# EAGLE design arcReactor (EAGLE 8.5.2)

## Sheet 1 of 2
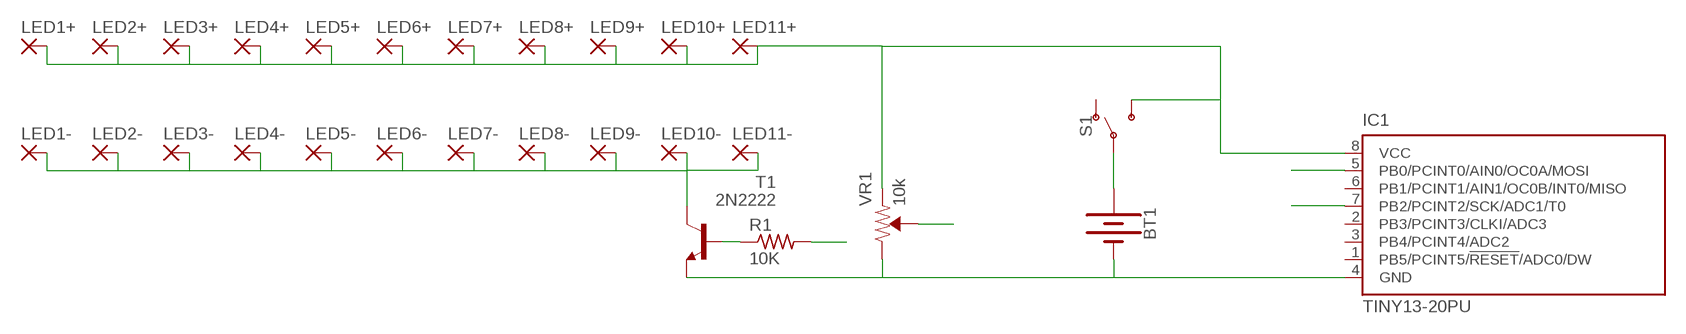
[diagram p0: schematic, sheet 1]

### Parts
BT1  BATTERY-20MM_PTH  [BATTCOM_20MM_PTH]
IC1  TINY13-20PU  [DIL08]
LED1+  SMD2  [SMD1,27-2,54]
LED1-  SMD2  [SMD1,27-2,54]
LED2+  SMD2  [SMD1,27-2,54]
LED2-  SMD2  [SMD1,27-2,54]
LED3+  SMD2  [SMD1,27-2,54]
LED3-  SMD2  [SMD1,27-2,54]
LED4+  SMD2  [SMD1,27-2,54]
LED4-  SMD2  [SMD1,27-2,54]
LED5+  SMD2  [SMD1,27-2,54]
LED5-  SMD2  [SMD1,27-2,54]
LED6+  SMD2  [SMD1,27-2,54]
LED6-  SMD2  [SMD1,27-2,54]
LED7+  SMD2  [SMD1,27-2,54]
LED7-  SMD2  [SMD1,27-2,54]
LED8+  SMD2  [SMD1,27-2,54]
LED8-  SMD2  [SMD1,27-2,54]
LED9+  SMD2  [SMD1,27-2,54]
LED9-  SMD2  [SMD1,27-2,54]
LED10+  SMD2  [SMD1,27-2,54]
LED10-  SMD2  [SMD1,27-2,54]
LED11+  SMD2  [SMD1,27-2,54]
LED11-  SMD2  [SMD1,27-2,54]
R1  10K  R-US_0204/2V  [0204V]
S1  SWITCH-SPDT-PTH-11.6X4.0MM  [SWITCH_SPDT_PTH_11.6X4.0MM]
T1  2N2222  [TO92-EBC-OVAL]
VR1  10k  TRIMPOT-PTH-10MM-KNOB-1/2W-10%  [TRIMPOT-PTH-3386U]

### Nets
N$1: BT1.1(+) S1.2(P)
N$2: BT1.2(-) IC1.4(GND) T1.E VR1.3(CW)
N$3: IC1.8(VCC) LED1+.1(P) LED2+.1(P) LED3+.1(P) LED4+.1(P) LED5+.1(P) LED6+.1(P) LED7+.1(P) LED8+.1(P) LED9+.1(P) LED10+.1(P) LED11+.1(P) S1.3(S) VR1.1(CCW)
N$4: R1.1 T1.B
N$5: LED1-.1(P) LED2-.1(P) LED3-.1(P) LED4-.1(P) LED5-.1(P) LED6-.1(P) LED7-.1(P) LED8-.1(P) LED9-.1(P) LED10-.1(P) LED11-.1(P) T1.C
POTSENSE: IC1.7(PB2/PCINT2/SCK/ADC1/T0) VR1.2(WIPER)
PWMCTRL: IC1.5(PB0/PCINT0/AIN0/OC0A/MOSI) R1.2
Unconnected: IC1.1(PB5/PCINT5/!RESET!/ADC0/DW) IC1.2(PB3/PCINT3/CLKI/ADC3) IC1.3(PB4/PCINT4/ADC2) IC1.6(PB1/PCINT1/AIN1/OC0B/INT0/MISO) S1.1(O)

## Sheet 2 of 2

## Library data of the parts
BT1 = SparkFun-Batteries:BATTERY: Battery - Single Cell A variety of battery chemistries, sizes, and footprints. Device List: 20MM_PTH - Coin Cell Battery Holder - 20mm (PTH) <https://www.sparkfun.com/products/783> 6.8MM_PTH - Coin Cell Battery Holder - 6.8MM(SMD) <https://www.digikey.com/product-detail/en/seiko-instruments/MS621FE-FL11E/728-1057-ND/1889208?WT.srch=1&gclid=CNOQ5a6LzdQCFZS2wAodXCkE0g> 12MM_SMD - Coin Cell Battery Holder - 12mm (SMD) <https://www.sparkfun.com/products/10592> 12MM_PTH - Coin Cell Battery Holder - 12mm (PTH) <https://www.sparkfun.com/products/7948> 20MM_SMD - 20mm Coin Cell Battery Holder (SMD) (2 legs) Used on the Big Time Watch Kit <https://www.sparkfun.com/products/11734> 20MM_SMD_4LEGS - Coin Cell Battery Holder - 20mm (SMD) <https://www.sparkfun.com/products/11892> 20MM_SMD_4LEGS_OVERPASTE - Coin Cell Battery Holder - 20mm (SMD) <https://www.sparkfun.com/products/11892> (Over-paste on the legs) 24.5MM_PTH - Coin Cell Battery Holder - 24.5mm (PTH) <https://www.sparkfun.com/products/8863> 9V - 9V Battery Holder - PC Mount Used on the SparkFun SparkPunk Sound Kit <https://www.sparkfun.com/products/11177> and SparkFun SparkPunk Sequencer Kit <https://www.sparkfun.com/products/12707> 18650 - Battery Holder - 18650 (PTH) <https://www.sparkfun.com/products/13113> AA - Battery Holder - 1xAA (PTH) <https://www.sparkfun.com/products/7949> AAA - Battery Holder - 1xAAA (PTH) <https://www.sparkfun.com/products/12718> AA_KIT - Battery Holder - 1xAA (PTH) <https://www.sparkfun.com/products/7949> Special kit package - pads only have exposed copper on one side of the board. AAA_KIT - Battery Holder - 1xAAA (PTH) <https://www.sparkfun.com/products/12718> Special kit package - pads only have exposed copper on one side of the board.; PROD_ID: BATT-09031; SF_SKU: PRT-00783
IC1 = atmel:TINY13: 8-bit AVR Microcontroller with 1K Bytes In-System Programmable Flash Source: http://www.atmel.com/dyn/resources/prod_documents/2535S.pdf; MPN: ATTINY13-20PU; OC_FARNELL: 9171550; OC_NEWARK: 96K6521
LED1+ LED1- LED2+ LED2- LED3+ LED3- LED4+ LED4- LED5+ LED5- LED6+ LED6- LED7+ LED7- LED8+ LED8- LED9+ LED9- LED10+ LED10- LED11+ LED11- = wirepad:SMD2: SMD PAD
R1 = adafruit:R-US_: RESISTOR, American symbol
S1 = SparkFun-Switches:SWITCH-SPDT: Single Pole, Double Throw (SPDT) Switch Single-pole, double-throw (SPDT) switch. Variant Overview SMD-AYZ0202 Surface Mount DPDT Switch <https://www.sparkfun.com/products/597> (COM-00597) Used on e.g. LilyPad Arduino USB - ATmega32U4 Board <https://www.sparkfun.com/products/12049> PTH-11.6X4.0MM SPDT Mini Power Switch <https://www.sparkfun.com/products/102> (COM-00102) Used on e.g. SparkFun Simon Says - Through-Hole Soldering Kit <https://www.sparkfun.com/products/10547> (KIT-10547) PTH-11.6X4.0MM-KIT KIT version of SPDT Mini Power Switch - Simplifies soldering by removing tStop of switch pins - only one side can be soldered. PTH-11.6X4.0MM-LOCK LOCK version of SPDT Mini Power Switch - Offset pins hold switch in place for easier soldering. SMD-RIGHT-ANGLE Surface Mount Right Angle Switch <https://www.sparkfun.com/products/10860> (COM-10860) Used on e.g. SparkFun ESP8266 Thing <https://www.sparkfun.com/products/13231>; PROD_ID: SWCH-08261; SF_SKU: COM-00102
T1 = adafruit:2N2222: NPN TRANSISTOR Big oval pads
VR1 = SparkFun-Resistors:TRIMPOT: Trimming Potentiometer (Trimpot) Three-terminal potentiometers, with an adjustable wiper and two adjustable resistors. A pot can be used to create a configurable voltage divider, or as a variable resistor. "Trimpots" are a subset of potentiometers, usually intended for "set-and-forget" applications. They're often more delicate than standard potentiometers - rated for fewer turns. Variants PTH-KNOB - PTH Trimpot w/ finger-adjustable knob Trimpot 10K with Knob <https://www.sparkfun.com/products/9806> (COM-09806) Datasheet <http://www.sparkfun.com/datasheets/Components/General/TSR-3386.pdf> SMD-3MM-CLOSED-FRAME - SMD 3mm Square Closed-Frame Trimpot Used on e.g. EasyDriver - Stepper Motor Driver <https://www.sparkfun.com/products/12779> Datasheet <http://www.bitechnologies.com/pdfs/22.pdf> (22AR10KTR) SMD-5MM - SMD 5mm Square Closed-Frame Trimpot Used on e.g. IOIO-OTG - V2.2 <https://www.sparkfun.com/products/13613> Datasheet <http://www.vishay.com/docs/51008/ts53.pdf> (TS53YL502MR10) SMD-3MM-1/10W-25% - 3mm Square Open-Frame Trimpot Used on e.g. SparkFun Shapeoko <https://www.sparkfun.com/products/13899> Datasheet <http://www.bourns.com/docs/Product-Datasheets/TC33.pdf> (TC33X-2-103E); PROD_ID: RES-09730; SF_SKU: COM-09806

## Board
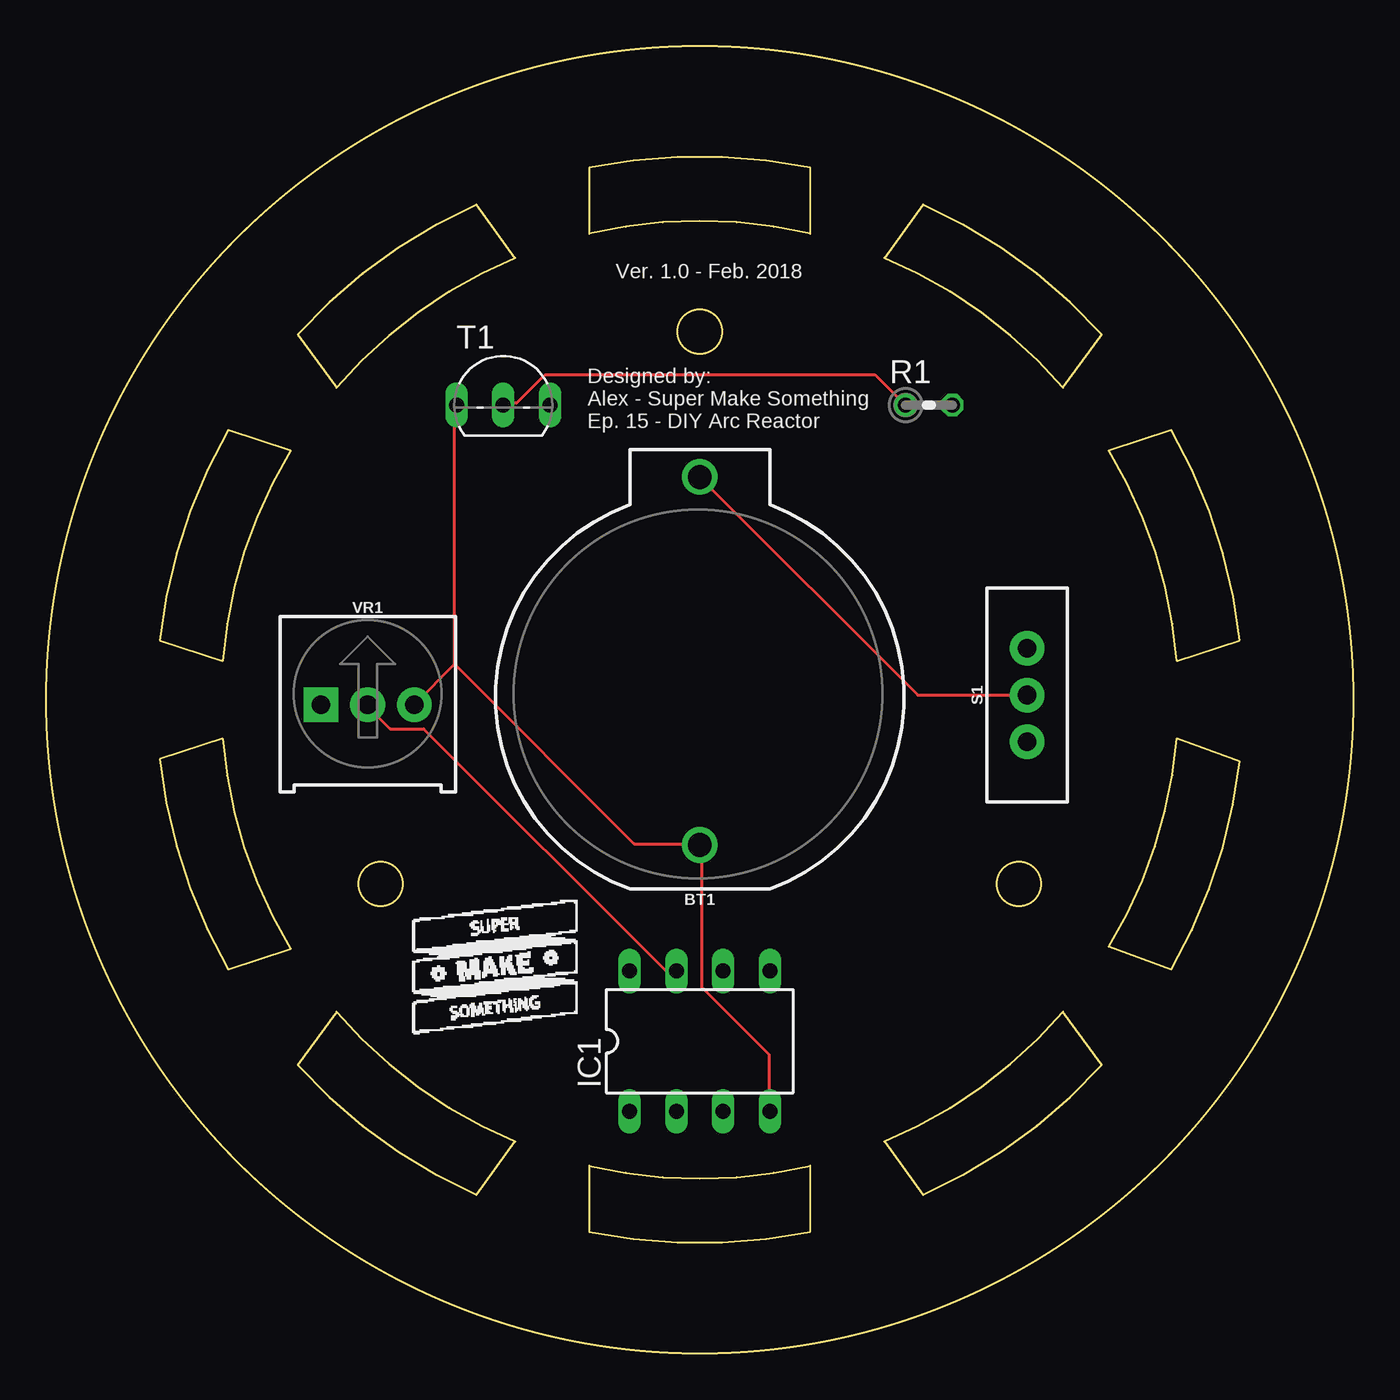
[diagram p1: board, top side]
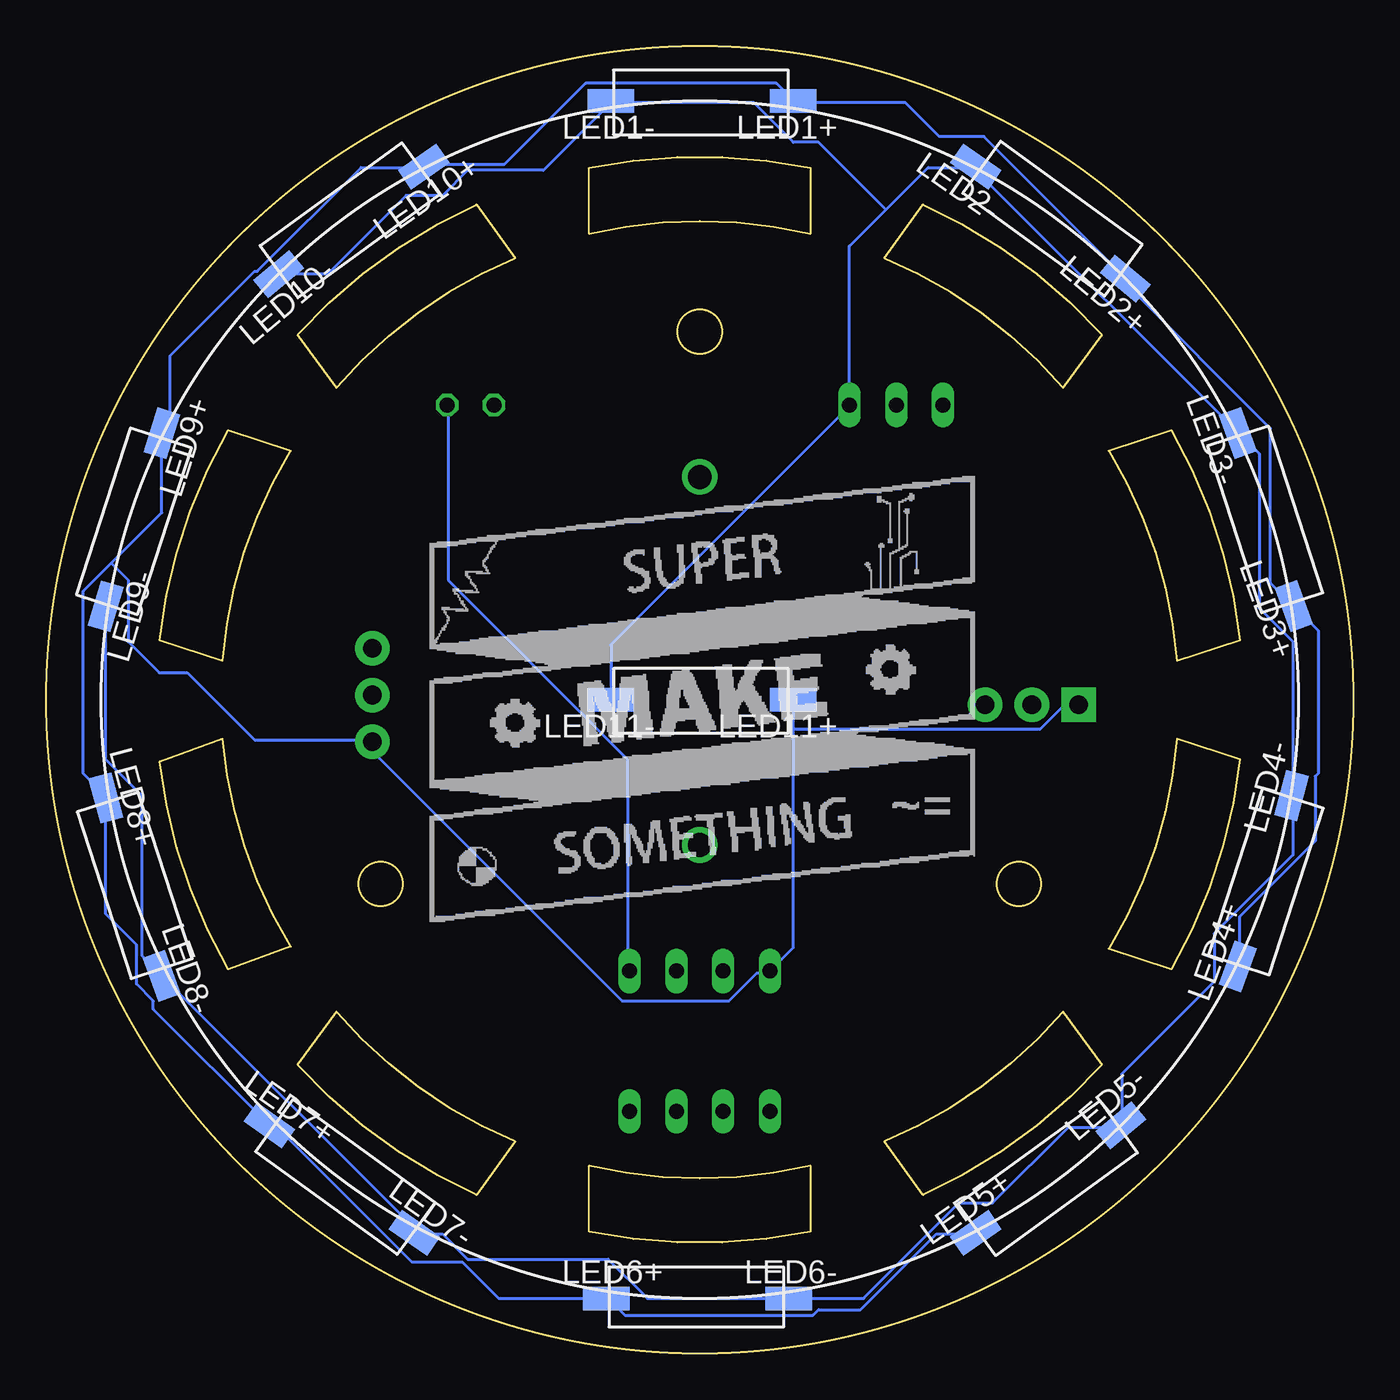
[diagram p2: board, bottom side, seen from below]

Size 71 x 71 mm. Coordinates in mm from the lower left corner, seen from the top.
Outline: 61.12,50.13 61.12,50.13
Outline: 61.12,50.13 57.71,49.02 arc-27 61.41,37.61 64.82,38.72 arc23 61.12,50.13
Outline: 9.88,20.87 9.88,20.87
Outline: 9.88,20.87 13.29,21.98 arc-27 9.59,33.39 6.18,32.28 arc23 9.88,20.87
Outline: 41.5,60.8 41.5,64.38 arc23 29.5,64.38 29.5,60.8 arc-27 41.5,60.8
Outline: 55.22,52.44 57.33,55.34 arc23 47.62,62.39 45.52,59.49 arc-27 55.22,52.44
Outline: 57.71,22.1 61.12,20.87 arc23 64.82,32.15 61.41,33.39 arc-27 57.71,22.1
Outline: 45.52,11.51 47.62,8.61 arc23 57.33,15.66 55.22,18.56 arc-27 45.52,11.51
Outline: 29.5,10.2 29.5,6.62 arc23 41.5,6.62 41.5,10.2 arc-27 29.5,10.2
Outline: 15.78,18.56 13.67,15.66 arc23 23.38,8.61 25.48,11.51 arc-27 15.78,18.56
Outline: 13.29,49.02 9.88,50.13 arc23 6.18,38.72 9.59,37.61 arc-27 13.29,49.02
Outline: 25.48,59.49 23.38,62.39 arc23 13.67,55.34 15.78,52.44 arc-27 25.48,59.49
Outline: circle at 18.18,25.5 radius 1.2
Outline: circle at 52.82,25.5 radius 1.2
Outline: circle at 35.5,55.5 radius 1.2
Outline: circle at 35.5,35.5 radius 35.5
Copper layers (1*16): Top 0.035559375mm / dielectric 1.6mm / Bottom 0.035559375mm
Design rules "oshpark-2layer": minimum track width 6mil, minimum drill 10mil, track to track 6mil, track to pad 6mil, pad to pad 6mil, via to via 6mil, smd to smd 6mil, copper to edge 15mil, drill to drill 6mil, minimum pad ring 5mil, minimum via ring 5mil, stop-mask expansion 2.5mil, vias tented up to drill 0mil, thermal gap 10mil

### Footprints (pad centres in the part's own frame; a part is rotated, then mirrored left to right if it is on the bottom)
BATTCOM_20MM_PTH = drill 1.3: 1 11.85,0; 2 -8.15,0
DIL08 = drill 0.813 long: 1 -3.81,-3.81; 2 -1.27,-3.81; 3 1.27,-3.81; 4 3.81,-3.81; 5 3.81,3.81; 6 1.27,3.81; 7 -1.27,3.81; 8 -3.81,3.81
SMD1,27-2,54 = smd 1.27 x 2.54: 1 0,0
0204V = drill 0.813 octagon: 1 -1.27,0; 2 1.27,0
SWITCH_SPDT_PTH_11.6X4.0MM = drill 1.016 pad 1.88: 1 0,2.54; 2 0,0; 3 0,-2.54
TO92-EBC-OVAL = drill 0.813 long: B 0,-1.27; C 2.54,-1.27; E -2.54,-1.27
TRIMPOT-PTH-3386U = drill 1.016 pad 1.88 square: 1 -2.54,-0.015 | drill 1.016 pad 1.88: 2 0,-0.015; 3 2.54,-0.015

### Placement (x,y rotation side)
BT1  35.5,35.75 90 top
IC1  35.5,16.96 0 top
LED1+  30.42,68.01 90 bottom
LED1-  40.33,68.01 90 bottom
LED2+  12.39,58.36 50 bottom
LED2-  20.51,64.46 55 bottom
LED3+  3.24,40.58 20 bottom
LED3-  6.29,49.98 20 bottom
LED4+  6.29,21.02 340 bottom
LED4-  3.37,30.29 345 bottom
LED5+  20.51,6.54 305 bottom
LED5-  12.64,12.39 310 bottom
LED6+  40.58,2.99 270 bottom
LED6-  30.67,2.99 270 bottom
LED7+  58.87,12.39 235 bottom
LED7-  50.99,6.54 235 bottom
LED8+  67.76,30.17 195 bottom
LED8-  64.71,20.51 200 bottom
LED9+  64.71,49.98 162.5 bottom
LED9-  67.76,40.58 163.6 bottom
LED10+  50.49,64.46 125 bottom
LED10-  58.36,58.61 130 bottom
LED11+  30.42,35.5 90 bottom
LED11-  40.33,35.5 90 bottom
R1  47.95,51.5 0 top
S1  53.28,35.75 0 top
T1  24.83,52.77 0 top
VR1  17.47,35.25 0 top

### Tracks (layer width: path | path; a pad name or v marks a point on that pad's centre or on a via)
N$1
  Top 0.152: S1.2 47.34,35.75 35.6,47.49 BT1.1
N$2
  Top 0.152: IC1.4 39.26,13.2 39.26,16.25 35.6,19.9 35.6,27.52 BT1.2 35.45,27.68 31.94,27.68 22.19,37.43 | 22.19,37.43 22.19,51.45 T1.E | 22.19,37.43 20.06,35.3 VR1.3
N$3
  Bottom 0.152: LED4+.1 6.19,21.12 6.19,23.71 2.07,27.83 2.07,31.33 1.92,31.49 1.92,39.26 LED3+.1 4.51,41.85 4.51,50.23 12.28,58 12.28,58.31 LED2+.1 12.44,58.46 20.06,66.08 22.49,66.08 24.32,67.91 30.42,67.91 LED1+.1 30.42,68.06 31.33,68.98 41.7,68.98 46.12,64.56 50.38,64.56 LED10+.1 50.54,64.41 53.89,64.41 59.53,58.77 59.68,58.77 64.25,54.19 64.25,50.54 64.71,50.08 LED9+.1 64.71,45.66 67.45,42.92 | 30.42,33.92 30.42,22.04 IC1.8 31.79,20.67 32.4,20.67 33.92,19.14 39.72,19.14 53.28,32.71 S1.3 53.28,33.32 59.68,33.32 63.34,36.97 64.86,36.97 66.54,38.65 66.54,42 67.45,42.92 | 30.42,33.92 LED11+.1 | 30.42,33.92 17.01,33.92 15.79,35.14 15.03,35.14 VR1.1 | LED5+.1 20.51,6.49 22.65,6.49 26.76,2.38 29.05,2.38 29.35,2.07 39.56,2.07 40.48,2.99 LED6+.1 46.42,2.99 48.4,4.97 51.15,4.97 58.46,12.28 58.77,12.28 LED7+.1 65.17,18.68 65.17,19.14 66.08,20.06 66.08,22.19 67.76,23.87 LED8+.1 67.76,30.27 68.98,31.49 68.98,41.39 67.45,42.92
N$4
  Top 0.152: R1.1 45.05,53.13 27.07,53.13 25.54,51.6 24.93,51.6 T1.B
N$5
  Bottom 0.152: LED9-.1 67.76,32.25 65.78,30.27 65.78,21.58 LED8-.1 50.99,6.8 LED7-.1 50.99,6.49 49.47,6.49 48.1,5.12 40.48,5.12 38.34,2.99 LED6-.1 26.61,2.99 21.43,8.17 19.6,8.17 15.48,12.28 12.74,12.28 LED5-.1 12.59,12.44 12.59,15.18 7.56,20.21 7.56,22.8 3.29,27.07 3.29,30.42 | 3.29,30.42 3.29,38.65 5.12,40.48 5.12,48.86 6.19,49.93 LED3-.1 6.34,50.08 20.67,64.41 | LED11-.1 40.33,38.5 27.37,51.45 T1.C 27.37,60.14 25.39,62.12 | 20.67,64.41 23.1,64.41 25.39,62.12 | 20.67,64.41 20.51,64.41 LED2-.1 20.67,64.41 | 40.33,67.91 32.55,67.91 30.42,65.78 29.05,65.78 25.39,62.12 | LED10-.1 55.72,58.61 51.45,62.88 49.47,62.88 48.1,64.25 43.98,64.25 40.33,67.91 | 40.33,67.91 LED1-.1 | 3.29,30.42 LED4-.1
POTSENSE
  Top 0.152: IC1.7 34.23,20.82 33.62,20.82 20.51,33.92 18.68,33.92 17.47,35.14 VR1.2
PWMCTRL
  Bottom 0.152: IC1.5 39.41,20.82 39.41,32.25 49.16,42 49.16,51.45 R1.2

### Text on the board
tPlace: Ver. 1.0 - Feb. 2018 | Designed by: / Alex - Super Make Something / Ep. 15 - DIY Arc Reactor